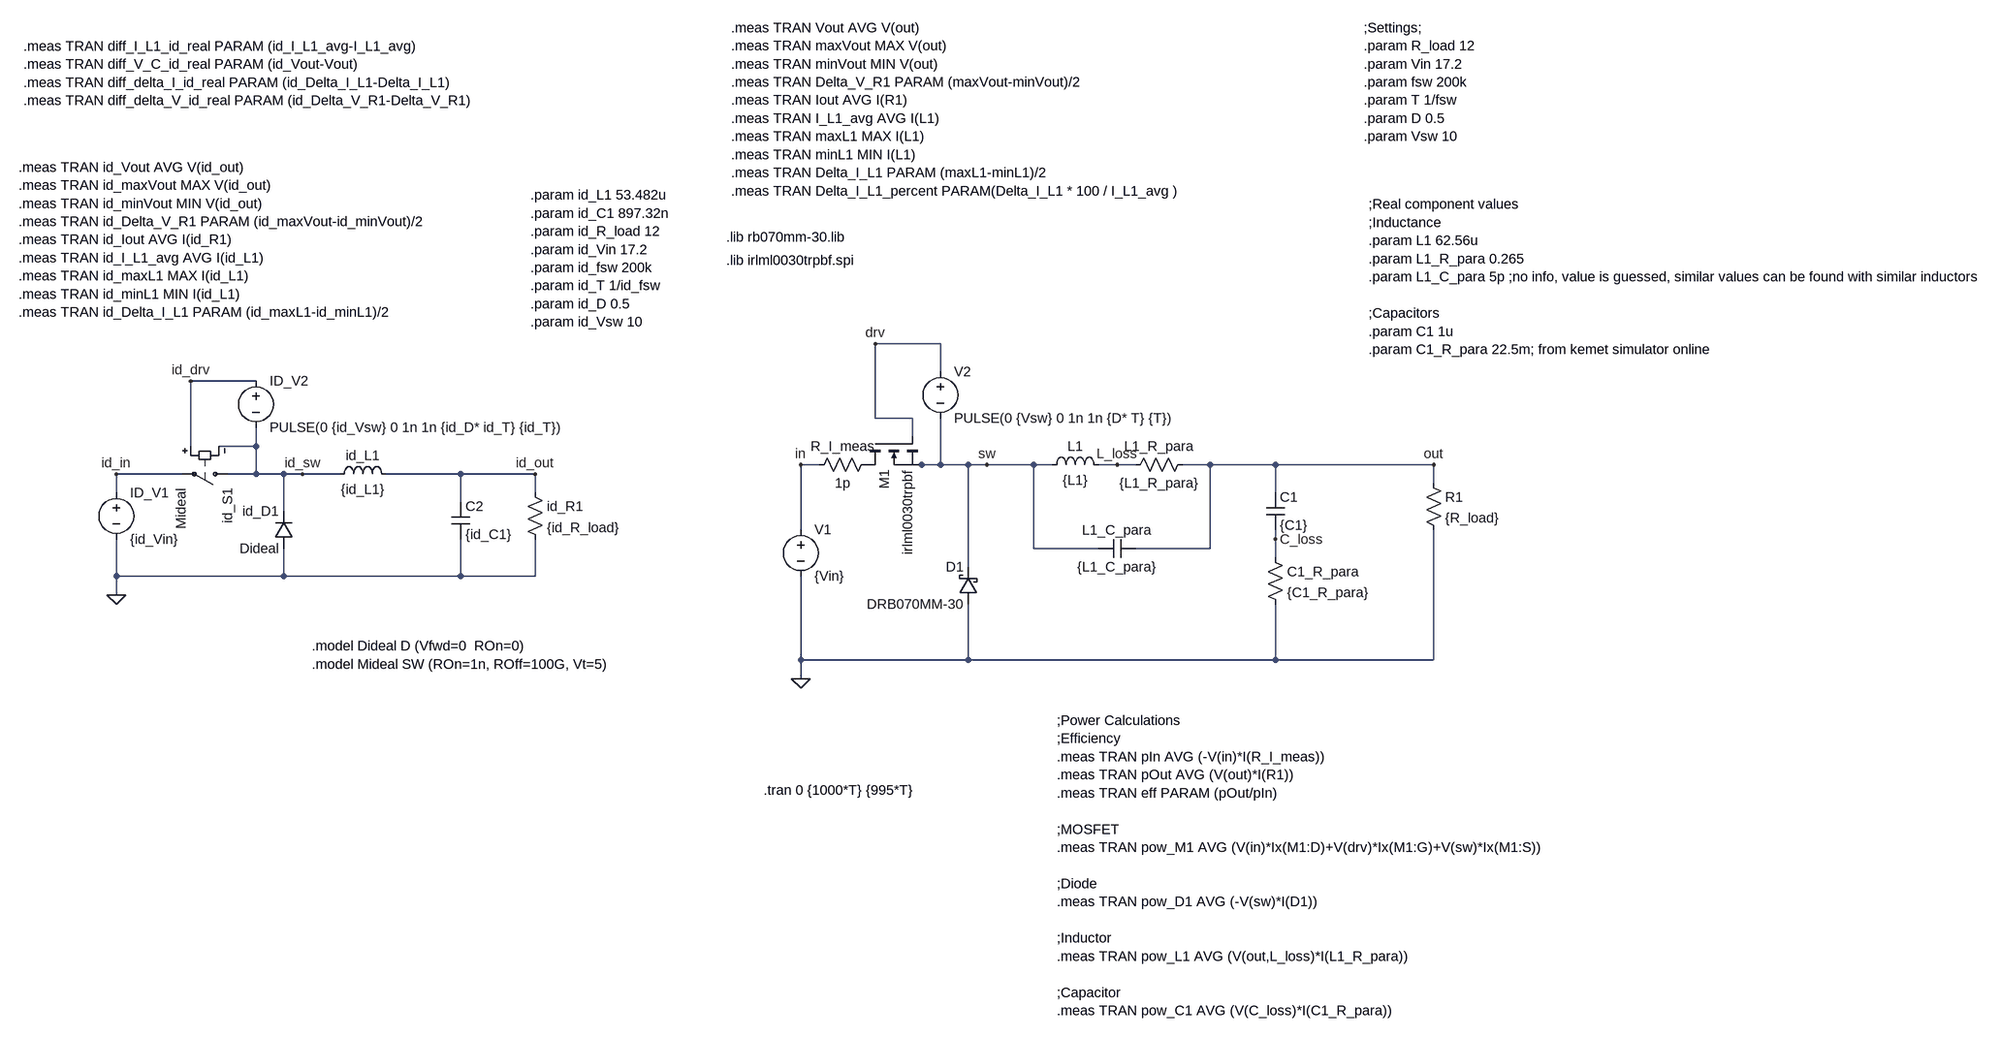
[diagram p0: schematic BoostMichaelGeuzeRealeBauteile.asc]
BoostMichaelGeuzeRealeBauteile.asc, the LTspice schematic file:
Version 4
SHEET 1 3432 1040
WIRE 352 -80 240 -80
WIRE 352 -32 352 -80
WIRE -848 -16 -960 -16
WIRE 240 48 240 -80
WIRE 304 48 240 48
WIRE 304 80 304 48
WIRE -960 96 -960 -16
WIRE -848 96 -848 64
WIRE -848 96 -912 96
WIRE 144 128 112 128
WIRE 320 128 304 128
WIRE 352 128 352 48
WIRE 352 128 320 128
WIRE 400 128 352 128
WIRE 432 128 400 128
WIRE 512 128 432 128
WIRE 544 128 512 128
WIRE 656 128 624 128
WIRE 688 128 656 128
WIRE 816 128 768 128
WIRE 928 128 816 128
WIRE 1200 128 928 128
WIRE -976 144 -1088 144
WIRE -848 144 -848 96
WIRE -848 144 -896 144
WIRE -800 144 -848 144
WIRE -768 144 -800 144
WIRE -704 144 -768 144
WIRE -496 144 -624 144
WIRE -368 144 -496 144
WIRE 1200 160 1200 128
WIRE -1088 176 -1088 144
WIRE -368 176 -368 144
WIRE 928 176 928 128
WIRE -496 192 -496 144
WIRE -800 208 -800 144
WIRE 112 240 112 128
WIRE 928 256 928 240
WIRE 512 272 512 128
WIRE 624 272 512 272
WIRE 816 272 816 128
WIRE 816 272 688 272
WIRE 928 288 928 256
WIRE 400 304 400 128
WIRE -1088 320 -1088 256
WIRE -800 320 -800 272
WIRE -800 320 -1088 320
WIRE -496 320 -496 256
WIRE -496 320 -800 320
WIRE -368 320 -368 256
WIRE -368 320 -496 320
WIRE -1088 352 -1088 320
WIRE 112 464 112 320
WIRE 400 464 400 368
WIRE 400 464 112 464
WIRE 928 464 928 368
WIRE 928 464 400 464
WIRE 1200 464 1200 240
WIRE 1200 464 928 464
WIRE 112 496 112 464
FLAG 112 496 0
FLAG 432 128 sw
FLAG 1200 128 out
FLAG 112 128 in
FLAG -1088 352 0
FLAG -960 -16 id_drv
FLAG -768 144 id_sw
FLAG -368 144 id_out
FLAG -1088 144 id_in
FLAG 240 -80 drv
FLAG 928 256 C_loss
FLAG 656 128 L_loss
SYMBOL voltage 112 224 R0
SYMATTR InstName V1
SYMATTR Value {Vin}
SYMBOL res 1184 144 R0
SYMATTR InstName R1
SYMATTR Value {R_load}
SYMBOL cap 912 176 R0
SYMATTR InstName C1
SYMATTR Value {C1}
SYMBOL ind 528 144 R270
WINDOW 0 32 56 VTop 2
WINDOW 3 5 56 VBottom 2
SYMATTR InstName L1
SYMATTR Value {L1}
SYMBOL voltage 352 -48 R0
WINDOW 123 0 0 Left 0
WINDOW 39 0 0 Left 0
SYMATTR InstName V2
SYMATTR Value PULSE(0 {Vsw} 0 1n 1n {D* T} {T})
SYMBOL res 784 112 R90
WINDOW 0 0 56 VBottom 2
WINDOW 3 32 56 VTop 2
SYMATTR InstName L1_R_para
SYMATTR Value {L1_R_para}
SYMBOL cap 688 256 R90
WINDOW 0 0 32 VBottom 2
WINDOW 3 32 32 VTop 2
SYMATTR InstName L1_C_para
SYMATTR Value {L1_C_para}
SYMBOL res 912 272 R0
SYMATTR InstName C1_R_para
SYMATTR Value {C1_R_para}
SYMBOL schottky 416 368 R180
WINDOW 0 24 64 Left 2
WINDOW 3 24 0 Left 2
SYMATTR InstName D1
SYMATTR Value DRB070MM-30
SYMBOL nmos 224 80 M90
SYMATTR InstName M1
SYMATTR Value irlml0030trpbf
SYMATTR Prefix X
SYMBOL voltage -1088 160 R0
SYMATTR InstName ID_V1
SYMATTR Value {id_Vin}
SYMBOL res -384 160 R0
SYMATTR InstName id_R1
SYMATTR Value {id_R_load}
SYMBOL cap -512 192 R0
SYMATTR InstName C2
SYMATTR Value {id_C1}
SYMBOL ind -720 160 R270
WINDOW 0 32 56 VTop 2
WINDOW 3 5 56 VBottom 2
SYMATTR InstName id_L1
SYMATTR Value {id_L1}
SYMBOL diode -784 272 R180
WINDOW 0 24 64 Left 2
WINDOW 3 24 0 Left 2
SYMATTR InstName id_D1
SYMATTR Value Dideal
SYMBOL sw -880 144 R90
SYMATTR InstName id_S1
SYMATTR Value Mideal
SYMBOL voltage -848 -32 R0
WINDOW 123 0 0 Left 0
WINDOW 39 0 0 Left 0
SYMATTR InstName ID_V2
SYMATTR Value PULSE(0 {id_Vsw} 0 1n 1n {id_D* id_T} {id_T})
SYMBOL res 240 112 R90
WINDOW 0 0 56 VBottom 2
WINDOW 3 32 56 VTop 2
SYMATTR InstName R_I_meas
SYMATTR Value 1p
TEXT 1080 -624 Left 2 !;Settings;\n.param R_load 12\n.param Vin 17.2\n.param fsw 200k\n.param T 1/fsw\n.param D 0.5\n.param Vsw 10
TEXT 48 688 Left 2 !.tran 0 {1000*T} {995*T}
TEXT -8 -624 Left 2 !.meas TRAN Vout AVG V(out)\n.meas TRAN maxVout MAX V(out)\n.meas TRAN minVout MIN V(out)\n.meas TRAN Delta_V_R1 PARAM (maxVout-minVout)/2\n.meas TRAN Iout AVG I(R1)\n.meas TRAN I_L1_avg AVG I(L1)\n.meas TRAN maxL1 MAX I(L1)\n.meas TRAN minL1 MIN I(L1)\n.meas TRAN Delta_I_L1 PARAM (maxL1-minL1)/2\n.meas TRAN Delta_I_L1_percent PARAM(Delta_I_L1 * 100 / I_L1_avg )
TEXT 1088 -320 Left 2 !;Real component values\n;Inductance\n.param L1 62.56u\n.param L1_R_para 0.265\n.param L1_C_para 5p ;no info, value is guessed, similar values can be found with similar inductors\n \n;Capacitors\n.param C1 1u\n.param C1_R_para 22.5m; from kemet simulator online
TEXT -16 -264 Left 2 !.lib rb070mm-30.lib
TEXT -16 -224 Left 2 !.lib irlml0030trpbf.spi
TEXT -752 440 Left 2 !.model Dideal D (Vfwd=0  ROn=0)\n.model Mideal SW (ROn=1n, ROff=100G, Vt=5)
TEXT -376 -336 Left 2 !.param id_L1 53.482u\n.param id_C1 897.32n \n.param id_R_load 12\n.param id_Vin 17.2\n.param id_fsw 200k\n.param id_T 1/id_fsw\n.param id_D 0.5\n.param id_Vsw 10
TEXT -1256 -384 Left 2 !.meas TRAN id_Vout AVG V(id_out)\n.meas TRAN id_maxVout MAX V(id_out)\n.meas TRAN id_minVout MIN V(id_out)\n.meas TRAN id_Delta_V_R1 PARAM (id_maxVout-id_minVout)/2\n.meas TRAN id_Iout AVG I(id_R1)\n.meas TRAN id_I_L1_avg AVG I(id_L1)\n.meas TRAN id_maxL1 MAX I(id_L1)\n.meas TRAN id_minL1 MIN I(id_L1)\n.meas TRAN id_Delta_I_L1 PARAM (id_maxL1-id_minL1)/2
TEXT -1248 -592 Left 2 !.meas TRAN diff_I_L1_id_real PARAM (id_I_L1_avg-I_L1_avg)\n.meas TRAN diff_V_C_id_real PARAM (id_Vout-Vout)\n.meas TRAN diff_delta_I_id_real PARAM (id_Delta_I_L1-Delta_I_L1)\n.meas TRAN diff_delta_V_id_real PARAM (id_Delta_V_R1-Delta_V_R1)
TEXT 552 568 Left 2 !;Power Calculations\n;Efficiency\n.meas TRAN pIn AVG (-V(in)*I(R_I_meas))\n.meas TRAN pOut AVG (V(out)*I(R1))\n.meas TRAN eff PARAM (pOut/pIn)\n \n;MOSFET \n.meas TRAN pow_M1 AVG (V(in)*Ix(M1:D)+V(drv)*Ix(M1:G)+V(sw)*Ix(M1:S))\n \n;Diode\n.meas TRAN pow_D1 AVG (-V(sw)*I(D1))\n \n;Inductor\n.meas TRAN pow_L1 AVG (V(out,L_loss)*I(L1_R_para))\n \n;Capacitor\n.meas TRAN pow_C1 AVG (V(C_loss)*I(C1_R_para))

The netlist it stands for:
* BoostMichaelGeuzeRealeBauteile.asc
V1 in 0 {Vin}
R1 out 0 {R_load}
C1 out C_loss {C1}
L1 sw L_loss {L1}
V2 drv sw PULSE(0 {Vsw} 0 1n 1n {D* T} {T})
R§L1_R_para out L_loss {L1_R_para}
C§L1_C_para out sw {L1_C_para}
R§C1_R_para C_loss 0 {C1_R_para}
D1 0 sw DRB070MM-30
XM1 P001 drv sw irlml0030trpbf  ; pins D G S
V§ID_V1 id_in 0 {id_Vin}
R§id_R1 id_out 0 {id_R_load}
C2 id_out 0 {id_C1}
L§id_L1 id_sw id_out {id_L1}
D§id_D1 0 id_sw Dideal
S§id_S1 id_sw id_in id_drv id_sw Mideal
V§ID_V2 id_drv id_sw PULSE(0 {id_Vsw} 0 1n 1n {id_D* id_T} {id_T})
R_I_meas P001 in 1p
.model D D
.lib standard.dio
;Settings;
.param R_load 12
.param Vin 17.2
.param fsw 200k
.param T 1/fsw
.param D 0.5
.param Vsw 10
.tran 0 {1000*T} {995*T}
.meas TRAN Vout AVG V(out)
.meas TRAN maxVout MAX V(out)
.meas TRAN minVout MIN V(out)
.meas TRAN Delta_V_R1 PARAM (maxVout-minVout)/2
.meas TRAN Iout AVG I(R1)
.meas TRAN I_L1_avg AVG I(L1)
.meas TRAN maxL1 MAX I(L1)
.meas TRAN minL1 MIN I(L1)
.meas TRAN Delta_I_L1 PARAM (maxL1-minL1)/2
.meas TRAN Delta_I_L1_percent PARAM(Delta_I_L1 * 100 / I_L1_avg )
;Real component values
;Inductance
.param L1 62.56u
.param L1_R_para 0.265
.param L1_C_para 5p ;no info, value is guessed, similar values can be found with similar inductors
;Capacitors
.param C1 1u
.param C1_R_para 22.5m; from kemet simulator online
.lib rb070mm-30.lib
.lib irlml0030trpbf.spi
.model Dideal D (Vfwd=0  ROn=0)
.model Mideal SW (ROn=1n, ROff=100G, Vt=5)
.param id_L1 53.482u
.param id_C1 897.32n
.param id_R_load 12
.param id_Vin 17.2
.param id_fsw 200k
.param id_T 1/id_fsw
.param id_D 0.5
.param id_Vsw 10
.meas TRAN id_Vout AVG V(id_out)
.meas TRAN id_maxVout MAX V(id_out)
.meas TRAN id_minVout MIN V(id_out)
.meas TRAN id_Delta_V_R1 PARAM (id_maxVout-id_minVout)/2
.meas TRAN id_Iout AVG I(id_R1)
.meas TRAN id_I_L1_avg AVG I(id_L1)
.meas TRAN id_maxL1 MAX I(id_L1)
.meas TRAN id_minL1 MIN I(id_L1)
.meas TRAN id_Delta_I_L1 PARAM (id_maxL1-id_minL1)/2
.meas TRAN diff_I_L1_id_real PARAM (id_I_L1_avg-I_L1_avg)
.meas TRAN diff_V_C_id_real PARAM (id_Vout-Vout)
.meas TRAN diff_delta_I_id_real PARAM (id_Delta_I_L1-Delta_I_L1)
.meas TRAN diff_delta_V_id_real PARAM (id_Delta_V_R1-Delta_V_R1)
;Power Calculations
;Efficiency
.meas TRAN pIn AVG (-V(in)*I(R_I_meas))
.meas TRAN pOut AVG (V(out)*I(R1))
.meas TRAN eff PARAM (pOut/pIn)
;MOSFET
.meas TRAN pow_M1 AVG (V(in)*Ix(M1:D)+V(drv)*Ix(M1:G)+V(sw)*Ix(M1:S))
;Diode
.meas TRAN pow_D1 AVG (-V(sw)*I(D1))
;Inductor
.meas TRAN pow_L1 AVG (V(out,L_loss)*I(L1_R_para))
;Capacitor
.meas TRAN pow_C1 AVG (V(C_loss)*I(C1_R_para))
.backanno
.end

* Results of the author's LTspice run, read from the files saved beside the schematic
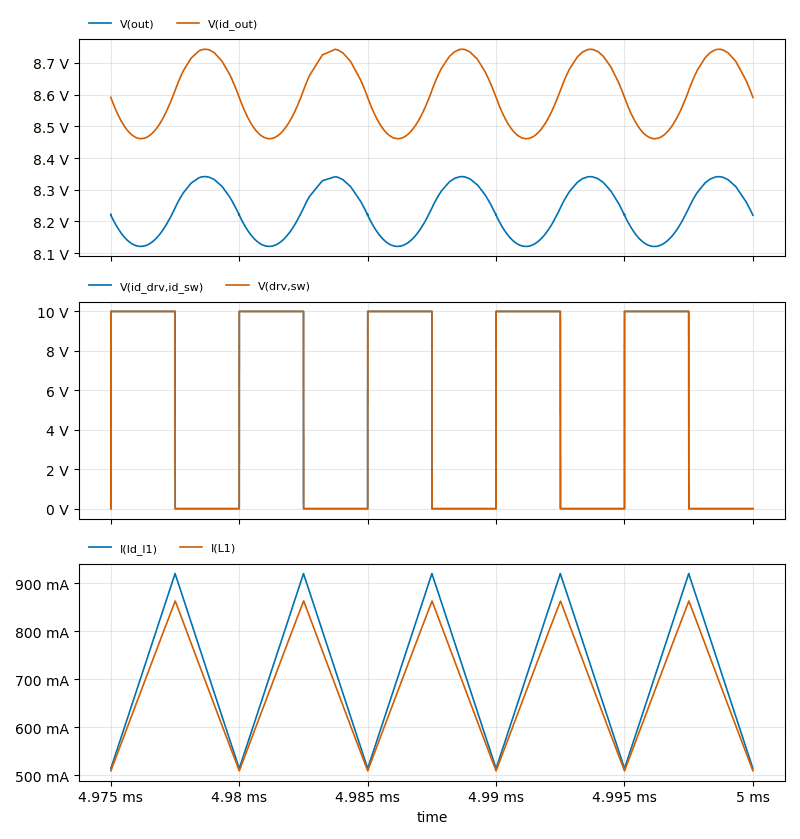
[diagram p1: Transient Analysis of BoostMichaelGeuzeRealeBauteile.asc, plotted from the saved traces]
* Transient Analysis, 1 run:
*   V(out): min 8.121 V, max 8.341 V, average 8.231 V, rms 8.231 V, last 8.219 V
*   V(id_out): min 8.461 V, max 8.743 V, average 8.602 V, rms 8.602 V, last 8.591 V
*   V(id_drv,id_sw): min 0 V, max 10 V, average 5.002 V, rms 7.072 V, last 0 V
*   V(drv,sw): min 0 V, max 10 V, average 5.002 V, rms 7.072 V, last 0 V
*   I(Id_l1): min 513.7 mA, max 920 mA, average 716.8 mA, rms 726.5 mA, last 513.7 mA
*   I(L1): min 508.8 mA, max 863 mA, average 685.9 mA, rms 693.6 mA, last 509 mA
* From the log:
*   vout: AVG(v(out))=8.23093 FROM 0 TO 2.5e-005
*   maxvout: MAX(v(out))=8.34157 FROM 0 TO 2.5e-005
*   minvout: MIN(v(out))=8.12098 FROM 0 TO 2.5e-005
*   delta_v_r1: (maxvout-minvout)/2=0.110294
*   iout: AVG(i(r1))=0.685911 FROM 0 TO 2.5e-005
*   i_l1_avg: AVG(i(l1))=0.685923 FROM 0 TO 2.5e-005
*   maxl1: MAX(i(l1))=0.862988 FROM 0 TO 2.5e-005
*   minl1: MIN(i(l1))=0.508809 FROM 0 TO 2.5e-005
*   delta_i_l1: (maxl1-minl1)/2=0.17709
*   delta_i_l1_percent=2.5e-005 FROM 0 TO 2.5e-005
*   id_vout: AVG(v(id_out))=8.60184 FROM 0 TO 2.5e-005
*   id_maxvout: MAX(v(id_out))=8.74336 FROM 0 TO 2.5e-005
*   id_minvout: MIN(v(id_out))=8.46103 FROM 0 TO 2.5e-005
*   id_delta_v_r1: (id_maxvout-id_minvout)/2=0.141167
*   id_iout: AVG(i(id_r1))=0.71682 FROM 0 TO 2.5e-005
*   id_i_l1_avg: AVG(i(id_l1))=0.716842 FROM 0 TO 2.5e-005
*   id_maxl1: MAX(i(id_l1))=0.920033 FROM 0 TO 2.5e-005
*   id_minl1: MIN(i(id_l1))=0.513658 FROM 0 TO 2.5e-005
*   id_delta_i_l1: (id_maxl1-id_minl1)/2=0.203188
*   diff_i_l1_id_real: (id_i_l1_avg-i_l1_avg)=0.0309185
*   diff_v_c_id_real: (id_vout-vout)=0.370908
*   diff_delta_i_id_real: (id_delta_i_l1-delta_i_l1)=0.026098
*   diff_delta_v_id_real: (id_delta_v_r1-delta_v_r1)=0.0308735
*   pin: AVG(-v(in)*i(r_i_meas))=5.88332 FROM 0 TO 2.5e-005
*   pout: AVG(v(out)*i(r1))=5.64622 FROM 0 TO 2.5e-005
*   eff: (pout/pin)=0.9597
*   pow_m1: AVG(v(in)*ix(m1:d)+v(drv)*ix(m1:g)+v(sw)*ix(m1:s))=0.0217412 FROM 0 TO 2.5e-005
*   pow_d1: AVG(-v(sw)*i(d1))=0.136951 FROM 0 TO 2.5e-005
*   pow_l1: AVG(v(out,l_loss)*i(l1_r_para))=0.127461 FROM 0 TO 2.5e-005
*   pow_c1: AVG(v(c_loss)*i(c1_r_para))=0.00023397 FROM 0 TO 2.5e-005